# Altium schematic sheet Bistable Clock.schdoc
size 123 x 67 mm
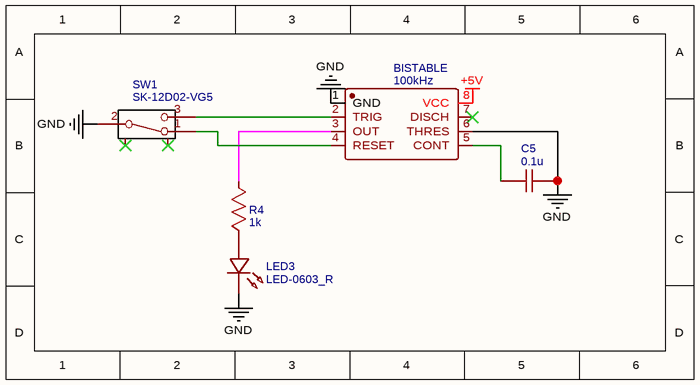
[diagram p0: Bistable Clock.schdoc]

## Parts
BISTABLE  100kHz  [SO-8_L4.9-W3.9-P1.27-LS5.9-BL]
C5  0.1u  [C0603]
LED3  LED-0603_R  [LED0603_RED]
R4  1k  [R0603]
SW1  SK-12D02-VG5  [SW-TH_SK-12D02VG3]

## Nets
+5V: BISTABLE.8(VCC)
GND: BISTABLE.1(GND) BISTABLE.6(THRES) C5.2 LED3.2 SW1.2
NetBISTABLE_2: BISTABLE.2(TRIG) SW1.3
NetBISTABLE_3: BISTABLE.3(OUT) R4.2
NetBISTABLE_4: BISTABLE.4(RESET) SW1.1
NetBISTABLE_5: BISTABLE.5(CONT) C5.1
NetLED3_1: LED3.1 R4.1

Not connected (* = marked no-connect by the designer): BISTABLE 7(DISCH)*; SW1 4* 5*

## Library data of the parts
BISTABLE = 100kHz: Manufacturer: TI(德州仪器); Manufacturer Part: NE555PSRE4; Contributor: lcsc; nameAlias: Value; Supplier: LCSC; Supplier Part: C2666911; spicePre: U; spiceSymbolName: NE555PSRE4
C5 = 0.1u: nameAlias: Value(F); Contributor: LCEDA_Lib; spicePre: C; spiceSymbolName: C_0603_US
LED3 = LED-0603_R: Manufacturer: EVERLIGHT(台湾亿光); Manufacturer Part: 19-217/R6C-AL1M2VY/3T; Contributor: LCEDA_01; Supplier Part: C72044; Supplier: LCSC; spicePre: L; spiceSymbolName: LED-0603_R
R4 = 1k: nameAlias: Value(Ω); Contributor: LCEDA_Lib; spicePre: R; spiceSymbolName: R_0603_US
SW1 = SK-12D02-VG5: Manufacturer: Rectangular Connectors - Contacts; Contributor: LCSC; Supplier: LCSC; Supplier Part: C136722; Manufacturer Part: SK-12D02-VG5; spicePre: S; spiceSymbolName: SK-12D02-VG5